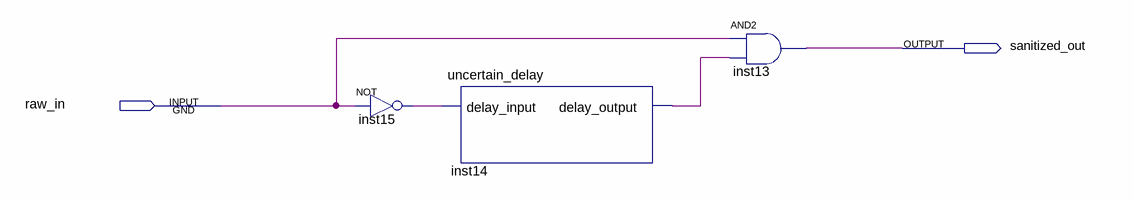
[diagram p0: schematic sheet]
// Quartus schematic input_sanitizer.bdf as structural Verilog: 3 symbols, 2 pins
module input_sanitizer (
  input  raw_in,
  output sanitized_out
);

  wire inst14_delay_output, inst15_out;

  not inst15 (inst15_out, raw_in);
  uncertain_delay inst14 (.delay_input(inst15_out), .delay_output(inst14_delay_output));
  and inst13 (sanitized_out, raw_in, inst14_delay_output);
endmodule
